# Altium schematic sheet TYPE-C 6P(040新)1_TYPE-C 6P(040新).schdoc.schdoc
size 124 x 99 mm
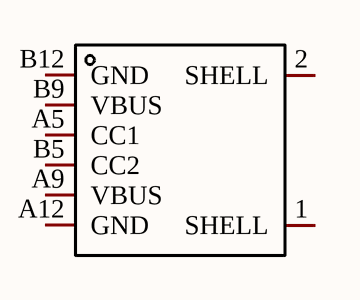
[diagram p0: TYPE-C 6P(040新)1_TYPE-C 6P(040新).schdoc.schdoc]

## Parts
USB?  TYPE-C 6P(040新)  [USB-C-SMD_TYPE-C-6P]  (value not drawn)

## Nets

Not connected (* = marked no-connect by the designer): USB? 1(SHELL) 2(SHELL) A5(CC1) A9(VBUS) A12(GND) B5(CC2) B9(VBUS) B12(GND)

## Library data of the parts
USB? = TYPE-C 6P(040新): Manufacturer: SHOU HAN(首韩); Add into BOM: yes; Gender: 母; Number of Ports: 1; Current Rating - Power (Max): 3A; Symbol: TYPE-C 6P(040新); Device: TYPE-C 6P(040新); Supplier: LCSC; Supplier Part: C2887422; Manufacturer Part: TYPE-C 6P(040新); JLCPCB Part Class: Extended Part; LCSC Part Name: Type-C 母 卧贴; Supplier Footprint: SMD; Datasheet: https://atta.szlcsc.com/upload/public/pdf/source/20210820/A6D4675B44FEA528A0512D7C06DEA92E.pdf; Convert to PCB: yes; Connector Type: Type-C; Standard: -; Number of Contacts: 6P; Mounting Style: 卧贴; Operating Temperature Range: -40℃~+85℃